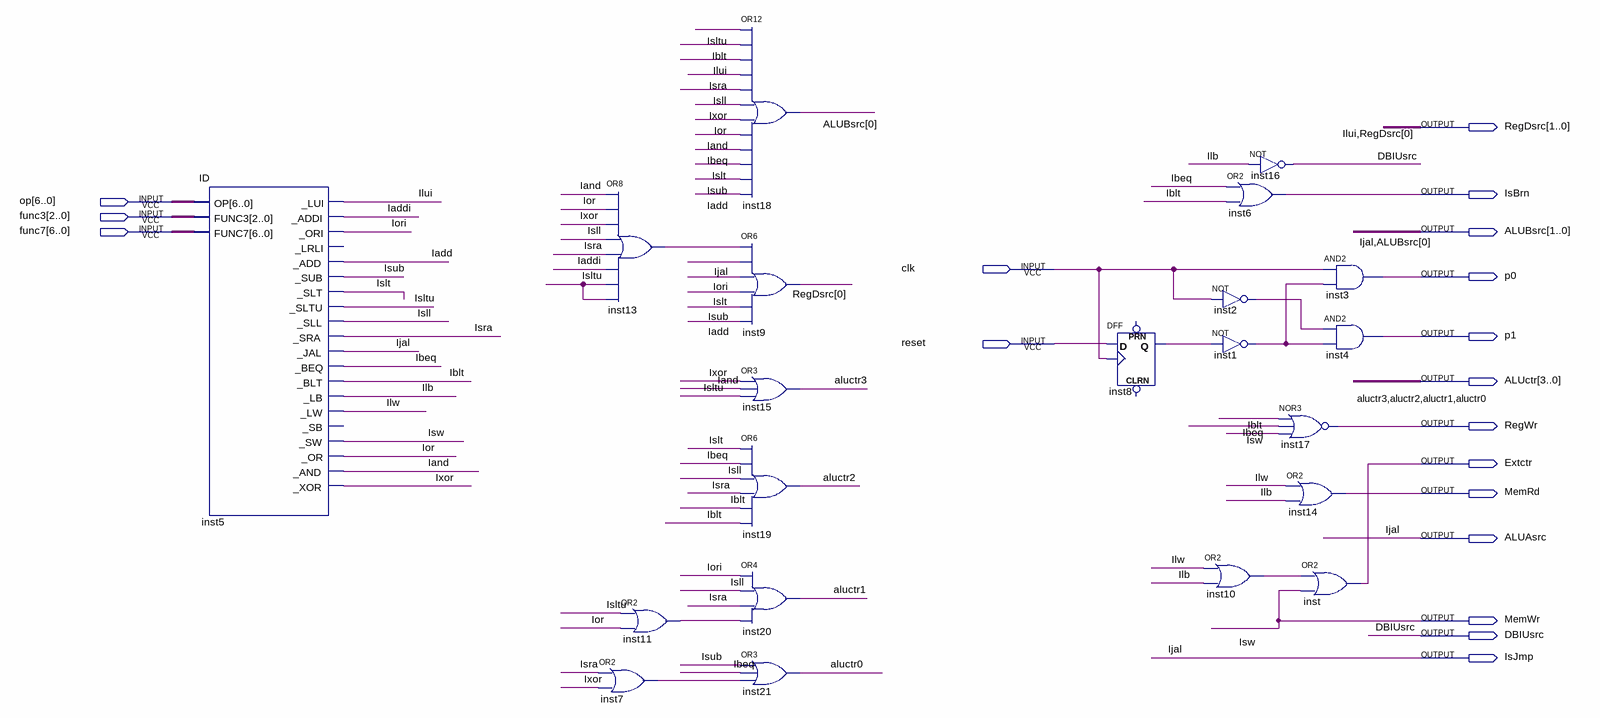
[diagram p0: schematic sheet]
// Quartus schematic control.bdf as structural Verilog: 21 symbols, 18 pins
module control (
  input  [6:0] op,
  input  [2:0] func3,
  input  [6:0] func7,
  input  clk,
  input  reset,
  output [1:0] RegDsrc,
  output IsBrn,
  output [1:0] ALUBsrc,
  output p0,
  output p1,
  output [3:0] ALUctr,
  output RegWr,
  output Extctr,
  output MemRd,
  output ALUAsrc,
  output MemWr,
  output DBIUsrc,
  output IsJmp
);

  wire Iadd, Iaddi, Iand, Ibeq, Iblt, Ilb, Ilw, inst1_out, inst2_out, inst7_out, inst8_q, inst10_out,
       inst11_out, inst13_out, Ior, Iori, Isll, Islt, Isltu, Isra, Isub, Ixor;

  ID inst5 (
    .OP(op), .FUNC3(func3), .FUNC7(func7), ._LUI(RegDsrc[1]), ._ADDI(Iaddi), ._ORI(Iori), ._ADD(Iadd),
    ._SUB(Isub), ._SLT(Islt), ._SLTU(Isltu), ._SLL(Isll), ._SRA(Isra), ._JAL(ALUAsrc), ._BEQ(Ibeq),
    ._BLT(Iblt), ._LB(Ilb), ._LW(Ilw), ._SW(MemWr), ._OR(Ior), ._AND(Iand), ._XOR(Ixor));  // open: _LRLI, _SB
  or inst13 (inst13_out, Iand, Ior, Ixor, Isll, Isra, Iaddi, Isltu, Isltu);
  or inst11 (inst11_out, Isltu, Ior);
  or inst7 (inst7_out, Isra, Ixor);
  or inst18 (ALUBsrc[0], Isltu, Iblt, RegDsrc[1], Isra, Isll, Ixor, Ior, Iand, Ibeq, Islt, Isub, Iadd);
  or inst9 (RegDsrc[0], inst13_out, ALUAsrc, Iori, Islt, Isub, Iadd);
  or inst15 (ALUctr[3], Ixor, Iand, Isltu);
  or inst19 (ALUctr[2], Islt, Ibeq, Isll, Isra, Iblt, Iblt);
  or inst20 (ALUctr[1], Iori, Isll, Isra, inst11_out);
  or inst21 (ALUctr[0], Isub, Ibeq, inst7_out);
  DFF inst8 (.CLK(clk), .D(reset), .Q(inst8_q));  // open: CLRN, PRN
  not inst16 (DBIUsrc, Ilb);
  or inst6 (IsBrn, Ibeq, Iblt);
  not inst2 (inst2_out, clk);
  not inst1 (inst1_out, inst8_q);
  or inst10 (inst10_out, Ilw, Ilb);
  nor inst17 (RegWr, Iblt, Ibeq, MemWr);
  or inst14 (MemRd, Ilw, Ilb);
  or inst (Extctr, inst10_out, MemWr);
  and inst3 (p0, clk, inst1_out);
  and inst4 (p1, inst2_out, inst1_out);

  assign ALUBsrc[1] = ALUAsrc;
  assign IsJmp = ALUAsrc;

  // Other names for the same wires on the sheet: Ijal = ALUAsrc; Ilui = RegDsrc[1]; Isw = MemWr
endmodule
